# Altium schematic sheet Charge and System Power-path Management Circuit For Vent.SchDoc
size A
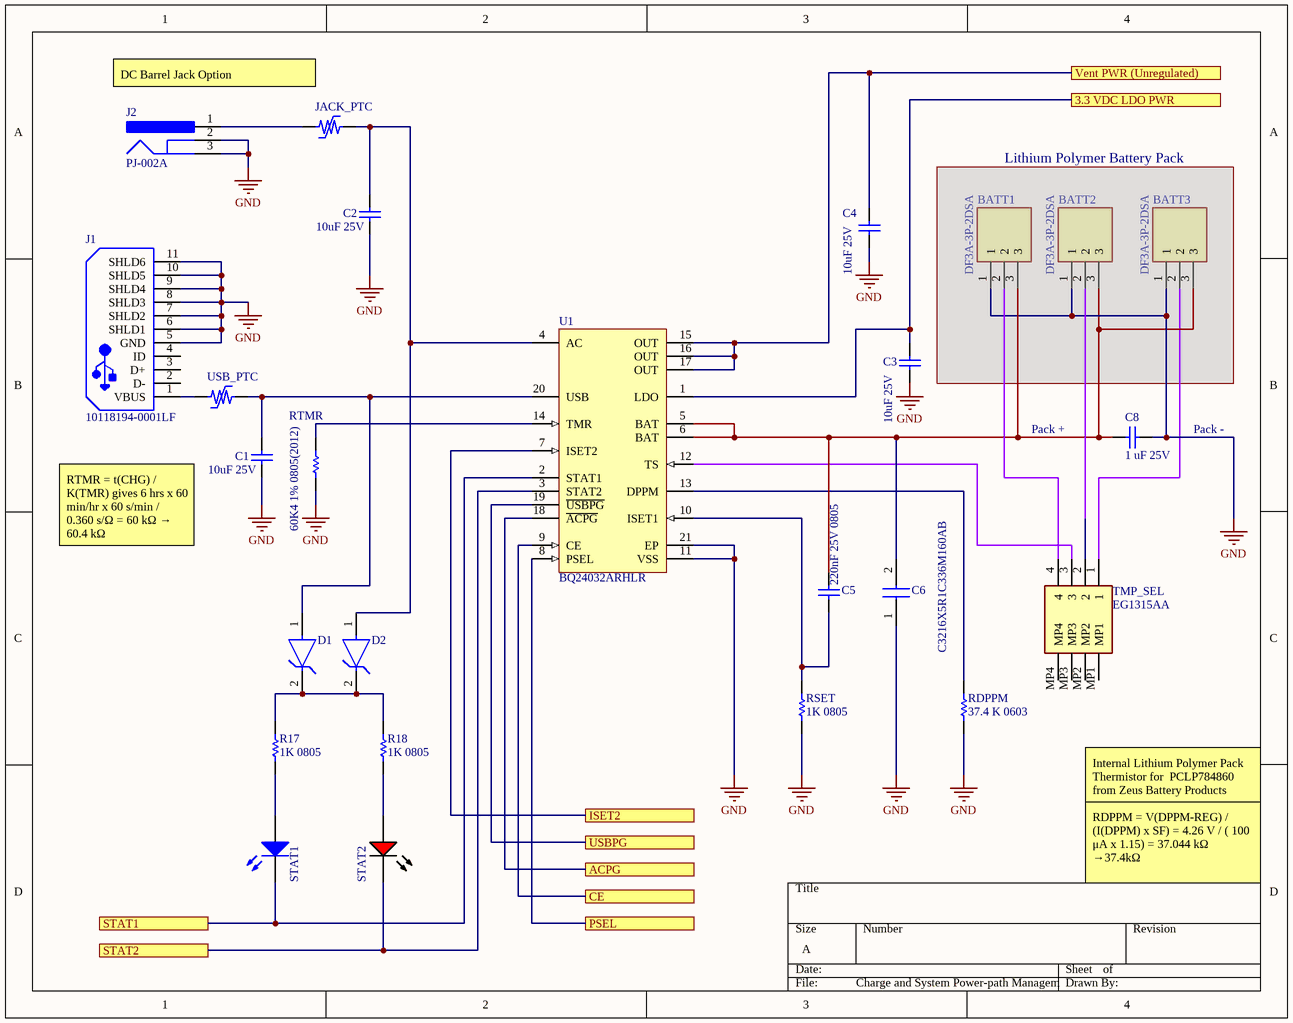
[diagram p0: Charge and System Power-path Management Circuit For Vent.SchDoc]

## Parts
BATT1  DF3A-3P-2DSA  [SHDR3W50P0X200_1X3_800X500X500P]
BATT2  DF3A-3P-2DSA  [SHDR3W50P0X200_1X3_800X500X500P]
BATT3  DF3A-3P-2DSA  [SHDR3W50P0X200_1X3_800X500X500P]
C1  10uF 25V  [CAPC2013X135X45ML10T25]
C2  10uF 25V  [CAPC2013X135X45ML10T25]
C3  10uF 25V  [CAPC2013X135X45ML10T25]
C4  10uF 25V  [CAPC2013X135X45ML10T25]
C5  220nF 25V 0805  [CAPC0805(2012)100_M]
C6  C3216X5R1C336M160AB  [C1206]
C8  1 uF 25V  [CAPC1608X90X35LL10T25]
D1  MM3Z3V3B  [FP-MM3Z3V3B-MFG]  (value not drawn)
D2  MM3Z3V3B  [FP-MM3Z3V3B-MFG]  (value not drawn)
J1  10118194-0001LF  [FCI-10118194-0001LF-5_V]
J2  PJ-002A  [CUI-PJ-002A_V]
JACK_PTC  MF-MSMF110/24X-2  [BOUR-MF-MSMF110-24X-2_V]  (value not drawn)
R17  1K 0805  [RESC2013X60X35ML10T20]
R18  1K 0805  [RESC2013X60X35ML10T20]
RDPPM  37.4 K 0603  [RESC1608X55X25ML10T15]
RSET  1K 0805  [RESC2013X60X35ML10T20]
RTMR  60K4 1% 0805(2012)  [RESC0805(2012)_M]
STAT1  (no value)  [1206_A]
STAT2  LTST-C150KRKT  [LTST-C150KRKT_V]  (value not drawn)
TMP_SEL  EG1315AA  [EG1315AA]
U1  BQ24032ARHLR  [RHL0020A_V]
USB_PTC  MF-MSMF110/24X-2  [BOUR-MF-MSMF110-24X-2_V]  (value not drawn)

## Blocks framed on the sheet
Lithium Polymer Battery Pack: BATT1-BATT3

## Ports
3.3 VDC LDO PWR, ACPG, CE, ISET2, PSEL, STAT1, STAT2, USBPG, Vent PWR (Unregulated)

## Nets
GND: BATT1.1 BATT2.1 BATT3.1 C1.1 C2.1 C3.1 C4.1 C6.1 C8.1 J1.5(GND) J1.6(SHLD1) J1.7(SHLD2) J1.8(SHLD3) J1.9(SHLD4) J1.10(SHLD5) J1.11(SHLD6) J2.2 J2.3 RDPPM.1 RSET.1 RTMR.1 U1.11(VSS) U1.21(EP)
3.3 VDC LDO PWR: C3.2 U1.1(LDO) ; port 3.3 VDC LDO PWR
ACPG: U1.18(~{ACPG}) ; port ACPG
CE: U1.9(CE) ; port CE
ISET2: U1.7(ISET2) ; port ISET2
PSEL: U1.8(PSEL) ; port PSEL
STAT1: STAT1.1(K) U1.2(STAT1) ; port STAT1
STAT2: STAT2.2(K) U1.3(STAT2) ; port STAT2
USBPG: U1.19(~{USBPG}) ; port USBPG
Vent PWR (Unregulated): C4.2 U1.15(OUT) U1.16(OUT) U1.17(OUT) ; port Vent PWR (Unregulated)
NetBATT1_2: BATT1.2 TMP_SEL.4
NetBATT1_3: BATT1.3 BATT2.3 BATT3.3 C5.2 C6.2 C8.2 U1.5(BAT) U1.6(BAT)
NetBATT2_2: BATT2.2 TMP_SEL.2
NetBATT3_2: BATT3.2 TMP_SEL.1
NetC1_2: C1.2 D1.1(A) U1.20(USB) USB_PTC.2
NetC2_2: C2.2 D2.1(A) JACK_PTC.2 U1.4(AC)
NetC5_1: C5.1 RSET.2 U1.10(ISET1)
NetD1_2: D1.2(C) D2.2(C) R17.2 R18.2
NetJ1_1: J1.1(VBUS) USB_PTC.1
NetJ2_1: J2.1 JACK_PTC.1
NetR17_1: R17.1 STAT1.2(A)
NetR18_1: R18.1 STAT2.1(A)
NetRDPPM_2: RDPPM.2 U1.13(DPPM)
NetRTMR_2: RTMR.2 U1.14(TMR)
NetTMP_SEL_3: TMP_SEL.3 U1.12(TS)

Not connected (* = marked no-connect by the designer): J1 2(D-) 3(D+) 4(ID); TMP_SEL MP1 MP2 MP3 MP4

## Notes on the sheet
- DC Barrel Jack Option
- Pack +
- Pack -
- RTMR = t(CHG) / K(TMR) gives 6 hrs x 60 min/hr x 60 s/min / 0.360 s/Ω = 60 kΩ →
  60.4 kΩ
- Internal Lithium Polymer Pack Thermistor for  PCLP784860 from Zeus Battery Products
- RDPPM = V(DPPM-REG) / (I(DPPM) x SF) = 4.26 V / ( 100 μA x 1.15) = 37.044 kΩ →37.4kΩ

## Library data of the parts
BATT1-BATT3 = DF3A-3P-2DSA: Connector; Manufacturer_Name: Hirose; Datasheet Link: https://componentsearchengine.com/Datasheets/2/DF3A-3P-2DSA.pdf; Height: 5mm; Manufacturer_Part_Number: DF3A-3P-2DSA; Arrow Part Number: DF3A-3P-2DSA; Mouser Part Number: 798-DF3A-3P-2DSA; Mouser Price/Stock: https://www.mouser.co.uk/ProductDetail/Hirose-Connector/DF3A-3P-2DSA?qs=Ux3WWAnHpjDjdLpYq8Mr3A%3D%3D
C1-C4 = CMP-2007-03541-1: Part Number: GRM21BR61E106KA73L; Manufacturer: Murata
C5 = CMP-1036-04543-1: CAP 220nF 25V ±10% 0805 (2012 Metric) Thickness 1mm SMD; Case-EIA: 0805; Tolerance: Â±10%; Case-Metric: 2012; Max Thickness: 1 mm; Value: 220nF; Technology: SMT; Rated Voltage: 25 V
C6 = C3216X5R1C336M160AB: Capacitor; Manufacturer_Name: TDK; Datasheet Link: https://product.tdk.com/info/en/catalog/datasheets/mlcc_commercial_midvoltage_en.pdf; Height: 1.8mm; Manufacturer_Part_Number: C3216X5R1C336M160AB; Arrow Part Number: C3216X5R1C336M160AB; Arrow Price/Stock: https://www.arrow.com/en/products/c3216x5r1c336m160ab/tdk; Mouser Part Number: 810-C3216X5R1C336M; Mouser Price/Stock: https://www.mouser.com/Search/Refine.aspx?Keyword=810-C3216X5R1C336M
C8 = CMP-2000-07260-1: Chip Capacitor, 1 uF, +/- 10%, 25 V, -55 to 85 degC, 0603 (1608 Metric), RoHS, Tape and Reel; PCN Part Number: X5R,X7RDielectrics23/Jan/2008; Manufacturer: Taiyo Yuden; Kits: 587-1797-KIT-ND-KITCAPCERHICAP0603&0805S; Other Names: 587-1248-1; Temperature Coefficient: X5R; Capacitance: 1µF; Catalog Drawings: xMKSeries_0603_0.8; Online Catalog: MSeries; Features: -; Datasheet Version: 09/2016; Mounting Type: SurfaceMount,MLCC; Voltage - Rated: 25V; Category: Capacitors; Tolerance: ±10%; Applications: GeneralPurpose; Ratings: -; Lead Spacing: -; Packaging: CutTape(CT); Family: CeramicCapacitors; Datasheet URL: http://ds.yuden.co.jp/TYCOMPAS/ut/detail.do?productNo=TMK107BJ105KA-T&fileName=TMK107BJ105KA-T_SS&mode=specSheetDownload; Thickness (Max): 0.035"(0.90mm); Operating Temperature: -55°C~85°C; Series: M; Manufacturer URL: http://www.t-yuden.com/; Size / Dimension: 0.063"Lx0.031"W(1.60mmx0.80mm); Package Reference: 0603; Lead Style: -; Package / Case: 0603(1608Metric); Mounting Technology: SurfaceMount; Height - Seated (Max): -; Standard Package: 1; Package Description: 2-Pin Surface Mount Device, Body 1.6 x 0.8 mm
D1 D2 = CMP-07164-000001-1: DIODE ZENER 3.3V 200MW SOD323F; Manufacturer: ON Semiconductor; Reverse Voltage: 1V; Max Reverse Leakage Current: 4.5uA; Max Zener Voltage: 3.37V; Zener Impedance: 89Ω; Forward Current: 10mA; Max Junction Temp: +150°C; ComponentLink2URL: https://www.onsemi.com/pub/Collateral/MM3Z9V1B-D.pdf; Automotive: No; Power Dissipation: 200mW; ComponentLink2Description: Datasheet; Octopart: https://octopart.com/mm3z3v3b-on+semiconductor-84329878; Category: Diode; Package: MM3Z3V3B; Height: 1mm; Device Class L1: Discrete Semiconductors; Mouser Description: Zener Diodes Diode Zener 3.3V 200mW 2%; Manufacturer Part Number: MM3Z3V3B; Device Class L2: Diodes; Temperature Range High: +150°C; Lead Free: Yes; Temperature: to +150°C; RoHS: TRUE; Digikey Description: DIODE ZENER 3.3V 200MW SOD323F; Nom Zener Voltage: 3.3V; Device Class L3: Zener Diodes
J1 = CMP-2000-05120-1: Micro USB B Type Receptacle, 1.8 A, -55 to 85 degC, 5-Pin SMD, RoHS, Tape and Reel; Manufacturer: Amphenol FCI; Body Orientation: RightAngle; Number of Contacts: 5; Pitch: 0.65mm; Gender: RCP; Rad Hard: No; Package Reference: 10118194-0001LF-5; Mounting: SurfaceMount; Manufacturer URL: http://www.fci.com/; Packaging: CutTape; Datasheet URL: https://datasheet.ciiva.com/26945/getdatasheetpartid-418619-26945695.pdf; Termination Method: Solder; Package Description: 5-Pin Surface Mount Device, Body 8.05 x 5.53 mm, Pitch 0.65 mm; Type: MicroUSBTypeB; Datasheet Version: Rev. A, 10/2011
J2 = CMP-2000-06895-1: Through Hole Right Angle DC Power Jack, 2.5 A, 2 mm Center Pin, 3 Position, -25 to 85 degC, RoHS, Bulk; Manufacturer: CUIInc.; Current Rating: 2.5A; Inside Contact Diameter: 2mm; Insulation Resistance: 50MOhms; Outside Contact Diameter: 6.5mm; Voltage Rating: 24V; Brand: CUI; Operating Temperature Range: -25Cto+85C; Mounting Technology: ThroughHole; Connector Type: DCPowerJack; Contact Material: Copper; Datasheet URL: http://www.cui.com/product/resource/pj-002a.pdf; Contact Gender: Male; Housing Material: PolybutyleneTerephthalate(PBT); Manufacturer URL: http://www.cui.com/; Package Reference: PJ-002A; Mounting Style: ThroughHole; Mounting Angle: Right; Product Category: DCPowerConnectors; Product: Jacks; Flammability Rating: UL94V-0; Contact Plating: Nickel; RoHS: True; Datasheet Version: Rev. 1.03, 04/2016; Package Description: 3-Pin Through Hole Device, Body 14.4 x 9 mm, Height 11 mm; Factory Pack Quantity: 500; Termination Style: ThroughHole
JACK_PTC USB_PTC = CMP-2100-03655-1: PTC Resettable Fuse, 24 V, 1.1 A, -40 to 85 degC, 2-Pin SMD, RoHS, Tape and Reel; Manufacturer: Bourns; Max Current Rating: 20A; Power Dissipation: 800mW; Supply Voltage: 24V; Number of Terminals: 2; Max Operating Temperature: 85degC; Case Code (Metric): 4532; Width: 3.41mm; RoHSCompliant: true; Contact Plating: Gold; Package Reference: MF-MSMF110-24X-2; Min Operating Temperature: -40degC; Packaging: TapeandReel; Mount: SurfaceMount; Case Code (Imperial): 1812; Length: 4.83mm; Height: 1.6mm; Case/Package: 1812; Datasheet URL: http://www.bourns.com/docs/Product-Datasheets/mfmsmf.pdf; Datasheet Version: Rev. AG, 08/2016; Voltage Rating: 24V; REACH SVHC: NoSVHC; Voltage Rating (DC): 24V; Radiation Hardening: No; Package Description: 2-Pin Surface Mount Device, Body 4.6 x 3.24 mm; Manufacturer URL: http://www.bourns.com/
R17 R18 RSET = CMP-2100-03671-1: Chip Resistor, 1 KOhm, +/- 1%, 125 mW, -55 to 155 degC, 0805 (2012 Metric), RoHS, Tape and Reel; Manufacturer: Yageo; Temperature Coefficient: 100ppm/degreesC; Voltage Rating (DC): 150V; Max Power Dissipation: 125mW; Resistance: 1KOhm; Number of Pins: 2; Number of Terminations: 2; Datasheet URL: http://www.yageo.com/NewPortal/yageodocoutput?fileName=/pdf/R-Chip/PYu-RC_Group_51_RoHS_L_5.pdf; Length: 0.079inch; Package Description: 2-Pin Surface Mounted Device, Body 2 x 1.25 mm; Depth: 1.25mm; Height: 0.024inch; Military Standard: Not; Case/Package: 0805; Package Reference: 0805; RoHSCompliant: true; Lead Free: LeadFree; Packaging: TapeandReel; Package Quantity: 1; Datasheet Version: Rev. 5, 10/2016; Tolerance: 1%; Min Operating Temperature: -55degC; Voltage Rating: 150V; Composition: ThickFilm; Case Code (Imperial): 0805; Power Rating: 125mW; Width: 0.049inch; Case Code (Metric): 2012; Manufacturer URL: http://www.yageo.com/; Max Operating Temperature: 155degC; REACH SVHC: Unknown; Termination: SMD/SMT
RDPPM = CMP-2000-04029-1: Manufacturer: Yageo; Part Number: RC0603FR-0737K4L
RTMR = CMP-1013-00711-1: 60K4 0.125W 1% 0805 (2012 Metric)  SMD; Value: 60400.00 Ohm; Case-EIA: 0805; Case-Metric: 2012; Power: 0.125 W; Technology: SMT; Tolerance: 1 %
STAT1 = CMP-1426-00016-1: LTST-C150GKT / 1206 green led; ComponentLink2URL: http://katalog.we-online.com/led/datasheet/150120VS75000.pdf; PartNumber: LTST-C150GKT; Color: Bright Green; ComponentLink2Description: Datasheet; ComponentLink1URL: http://www.we-online.com; PackageReference: 1206_A; ComponentLink1Description: Manufacturer URL
STAT2 = CMP-2000-06617-1: LED Red, 62.5 mW, 50 mA, -30 to 85 degC, 2-Pin SMD, RoHS, Tape and Reel; Manufacturer: Lite-On; Chip Material: AlGaInP; Product Depth (mm): 1.6mm; Luminous Intensity: 54mcd; Number of  Elements: 1; Reverse Voltage: 5V; Viewing Angle: 130deg; Rad Hardened: No; Shape Type: Rectangular; Peak Wavelength: 639nm; Forward Current: 30mA; Main Category: ChipLED; Product Height (mm): 1.1mm; Forward Voltage: 2.4V; Product Length (mm): 3.2mm; High Brightness: Yes; DELETED: Compliant; Test Current (It): 20mA; Power Dissipation: 75W; Dominant Wave Length: 631nm; Mounting: SurfaceMount; Package Type: ChipLed; Manufacturer URL: http://www.us.liteon.com/; Datasheet Version: Rev. C, 01/2013; Lens Dimensions: 2.06X1.6X0.6mm; Package Reference: C150KRKT; Operating Temp Range: -55Cto85C; Packaging: TapeandReel; Package Description: 2-Pin Surface Mount Device, Body 3.2 x 1.6 mm; Lum Intensity: 54mcd; Datasheet URL: http://optoelectronics.liteon.com/upload/download/DS-22-99-0149/S_110_LTST-C150KRKT.pdf; Emitting Color: Red; Operating Temperature Classification: Industrial; Mounting Technology: SurfaceMount; Type: Uni-Color; Pin Count: 2
TMP_SEL = EG1315AA: Switch; Manufacturer_Name: E-Switch; Datasheet Link: https://www.mouser.co.uk/datasheet/2/140/N131500-1501042.pdf; Height: 1.4mm; Manufacturer_Part_Number: EG1315AA; Arrow Part Number: EG1315AA; Mouser Part Number: 612-EG1315AA; Mouser Price/Stock: https://www.mouser.co.uk/ProductDetail/E-Switch/EG1315AA?qs=w%2Fv1CP2dgqqTYZUZmbcI7Q%3D%3D
U1 = CMP-0321-00146-2: Dual Input Li-Ion Charger with Dynamic Power Path, Output regulated to 4.4 V, Vbat 4.2 V, 4.3 V, -40 to 85 degC, 20-pin QFN (RHL), Green (RoHS & no Sb/Br); Manufacturer: Texas Instruments; Vin(Min)(V): 4.3; Li-Ion: Y; SubFamily: Battery Charge Management; NiCd: N; Mounting Technology: Surface Mount; DatasheetVersion: SLUS618H; PackageReference: RHL0020A; PartNumber: BQ24032ARHLR; Li-Polymer: Y; ComponentLink1Description: Datasheet; Over Voltage Protection: N; Eco-Plan: Green (RoHS & no Sb/Br); PackageVersion: revJ, Dec-2011; ComponentLink1URL: http://www.ti.com/general/docs/lit/getliterature.tsp?genericPartNumber=BQ24032A&fileType=pdf; Lead Acid: N; PackageDescription: 20-Leads Plastic Quad Flatpack No-Lead, 4.5 x 3.5 x 0.9 mm Body, 0.5 mm Pitch, Exposed Pad; NiMH: N